# EasyEDA Pro project ProPrj_42StepMotor_2025-09-30.epro, board motor
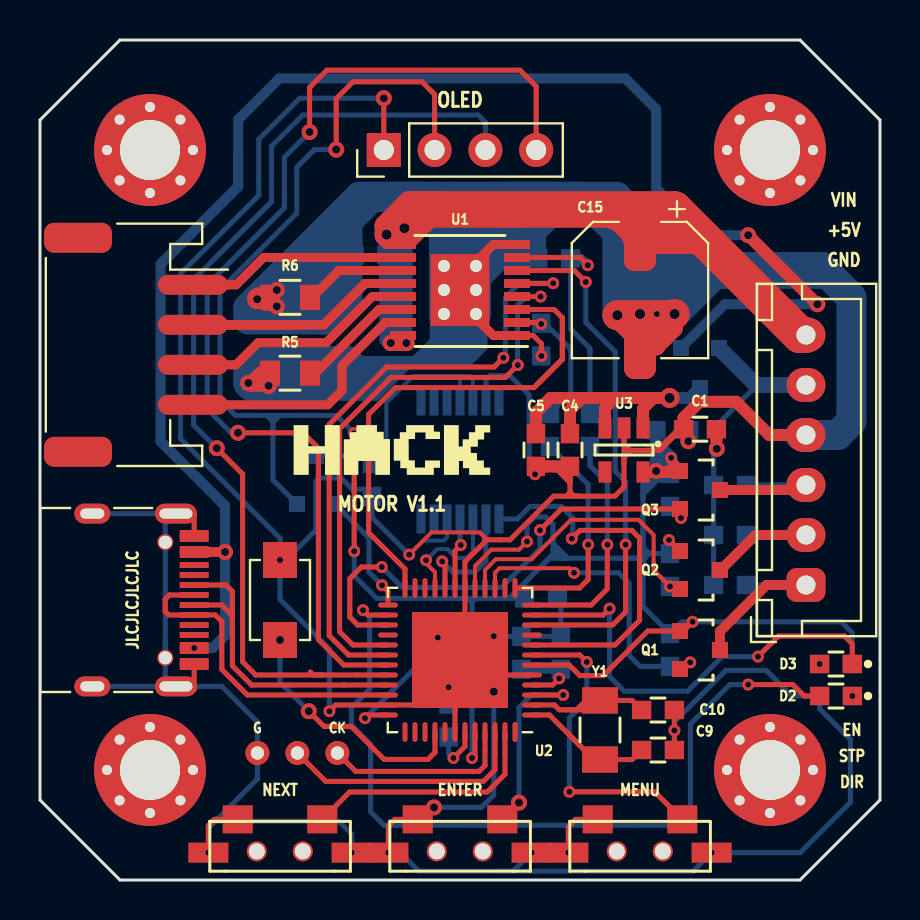
[diagram p2: board, top side]
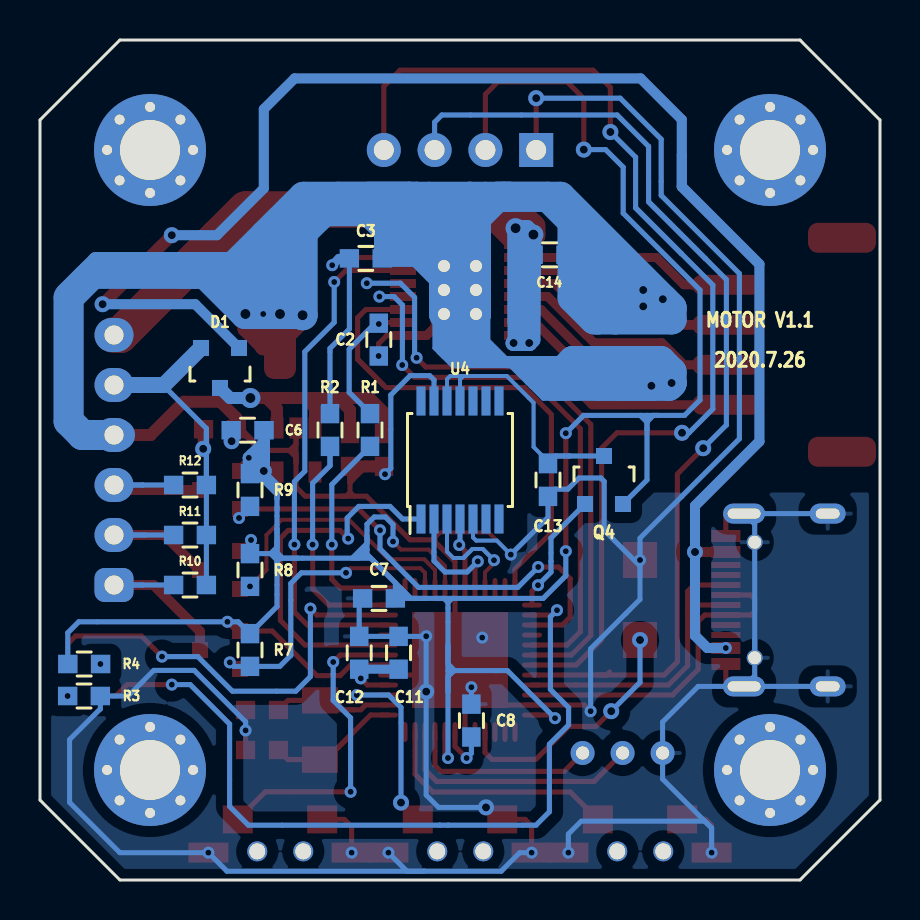
[diagram p3: board, bottom side, seen from below]

Outline 42 x 42 mm; copper layers: Top Layer, Bottom Layer. Coordinates in mm from the lower left corner of the outline.
Outline path: 0,38 4,42 38,42 42,38 42,4 38,0 4,0 0,4 0,38
Stack: Top Layer 0.035mm / Dielectric1 1.51mm FR4 er 4.5 / Bottom Layer 0.035mm

## Design rules (mm)
spacing safeClearance (default): track to track 0.152, other pairs 0.152 to 0.3
track width trackWidth (default): min 0.127, default 0.254, max 2.54
differential pair differentialPair (default): width min 0.127, default 0.254, max 2.54; gap min 0.152, default 0.152
via viaSize (default): diameter min 0.5, default 0.61, max 10; hole min 0.3, default 0.305, max 6
pour ie1768 uses CopperRegion

## Placement (name value [footprint] x y rotation side)
C1  0.1uF  [NewLibCool:0603_C]  33 22.54 0 top
C2  0.1uF  [NewLibCool:0603_C]  25.06 27.02 90 bottom
C3  0.1uF  [NewLibCool:0603_C]  25.71 31.08 0 bottom
C4  0.1uF  [NewLibCool:0603_C]  26.5 21.5 90 top
C5  0.1uF  [NewLibCool:0603_C]  24.8 21.5 90 top
C6  0.1uF  [NewLibCool:0603_C]  31.62 22.49 180 bottom
C7  0.1uF  [NewLibCool:0603_C]  25.05 14.08 180 bottom
C8  1uF  [NewLibCool:0603_C]  20.43 7.97 90 bottom
C9  10pF  [NewLibCool:0603_C]  30.9 8.5 180 top
C10  10pF  [NewLibCool:0603_C]  30.9 6.5 180 top
C11  0.1uF  [NewLibCool:0603_C]  24.07 11.36 270 bottom
C12  4.7uF  [NewLibCool:0603_C]  26.04 11.36 270 bottom
C13  0.1uF  [NewLibCool:0603_C]  16.6 20 90 bottom
C14  0.1uF  [NewLibCool:0603_C]  16.52 31.26 0 bottom
C15  100uF  [Capacitor_SMD:CP_Elec_6.3x5.4_Nichicon]  30 29.5 270 top
D1  BAT54C  [NewLibCool:SOT-23]  33 25.6 0 bottom
D2  LED  [NewLibCool:0603_LED]  39.8 9.2 180 top
D3  LED  [NewLibCool:0603_LED]  39.8 10.8 180 top
G***  LOGO  [NewLibCool:LOGO_HACK_10MM]  17.6 21.5 0 top
J1  CONN_01X04  [Connector_JST:JST_PH_S4B-PH-SM4-TB_1x04-1MP_P2.00mm_Horizontal]  4.8 26.76 270 top
J2  Conn_01x06_Male  [Connector_JST:JST_XH_B6B-XH-A_1x06_P2.50mm_Vertical]  38.3 14.75 90 top
J3  CONN_01X04  [Connector_PinHeader_2.54mm:PinHeader_1x04_P2.54mm_Vertical]  17.19 36.5 90 top
P1  -  [NewLibCool:USB-Type-C-NEW]  7.71 14 270 top
P1#2  -  [NewLibCool:O_5.6_3mm]  5.5 36.5 0 top
P1#3  -  [NewLibCool:O_5.6_3mm]  36.5 5.5 0 top
P1#4  -  [NewLibCool:O_5.6_3mm]  5.5 5.5 0 top
P1#5  -  [NewLibCool:O_5.6_3mm]  36.5 36.5 0 top
P2  CONN_01X03  [NewLibCool:JLINK3]  11.87 6.35 270 top
Q1  BSS138  [NewLibCool:SOT-23]  33 11.5 270 top
Q2  BSS138  [NewLibCool:SOT-23]  33 15.5 270 top
Q3  BSS138  [NewLibCool:SOT-23]  33 19.5 270 top
Q4  AO3401A  [NewLibCool:SOT-23-L]  13.8 20 180 bottom
R1  3.3K  [NewLibCool:0603_R]  25.5 22.5 270 bottom
R2  3.3K  [NewLibCool:0603_R]  27.5 22.5 270 bottom
R3  3.3K  [NewLibCool:0603_R]  39.8 9.2 180 bottom
R4  3.3K  [NewLibCool:0603_R]  39.79 10.8 0 bottom
R5  0.1R  [NewLibCool:0805_R]  12.5 25.34 0 top
R6  0.1R  [NewLibCool:0805_R]  12.5 29.13 0 top
R7  10K  [NewLibCool:0603_R]  31.5 11.5 90 bottom
R8  10K  [NewLibCool:0603_R]  31.5 15.5 90 bottom
R9  10K  [NewLibCool:0603_R]  31.5 19.5 90 bottom
R10  10K  [NewLibCool:0603_R]  34.5 14.75 180 bottom
R11  10K  [NewLibCool:0603_R]  34.5 17.25 180 bottom
R12  10K  [NewLibCool:0603_R]  34.5 19.75 180 bottom
SW1  ENTER  [NewLibCool:SWITCH_PUSH]  21 2.2 0 top
SW2  MENU  [NewLibCool:SWITCH_PUSH]  30 2.2 0 top
SW3  NEXT  [NewLibCool:SWITCH_PUSH]  12 2.2 0 top
SW4  RESET  [NewLibCool:switchx3x4]  12 14 90 top
U1  A4954  [Package_SO:TSSOP-16-1EP_4.4x5mm_P0.65mm]  21 29.5 180 top
U2  ATSAMD21G18A-MF  [NewLibCool:QFN-48-1EP_7x7mm_P0.5mm_ATSAMD21G18]  21 11 180 top
U3  SPX3819  [NewLibCool:SOT23-5]  29.2 21.5 270 top
U4  AS5047D  [Package_SO:TSSOP-14_4.4x5mm_P0.65mm]  21 21 90 bottom
Y1  32.768KHz  [NewLibCool:OSC_32.768_Mini]  28 7.5 270 top

## Footprints (pads in the part's own frame, mm; a bottom-side part is the same pattern mirrored in y, then rotated)
Capacitor_SMD:CP_Elec_6.3x5.4_Nichicon
  rrect 3.5x1.6 smd: 1(-2.7,0) 2(2.7,0)
Connector_JST:JST_PH_S4B-PH-SM4-TB_1x04-1MP_P2.00mm_Horizontal
  rrect 1x3.5 smd: 1(-3,2.85) 2(-1,2.85) 3(1,2.85) 4(3,2.85)
  rrect 1.5x3.4 smd: MP(-5.35,-2.9) MP(5.35,-2.9)
Connector_JST:JST_XH_B6B-XH-A_1x06_P2.50mm_Vertical
  rrect 1.7x1.95 hole 0.95: 1(0,0)
  oval 1.7x1.95 hole 0.95: 2(2.5,0) 3(5,0) 4(7.5,0) 5(10,0) 6(12.5,0)
Connector_PinHeader_2.54mm:PinHeader_1x04_P2.54mm_Vertical
  rect 1.7x1.7 hole 1: 1(0,0)
  round 1.7 hole 1: 2(0,-2.54) 3(0,-5.08) 4(0,-7.62)
NewLibCool:0603_C
  rect 0.965x0.92 smd: 1(-0.82,0) 2(0.82,0)
NewLibCool:0603_LED
  rect 0.965x0.92 smd: 1(-0.82,0) 2(0.82,0)
NewLibCool:0603_R
  rect 0.965x0.92 smd: 1(-0.82,0) 2(0.82,0)
NewLibCool:0805_R
  rect 1x1.25 smd: 1(-1,0) 2(1,0)
NewLibCool:JLINK3
  round 1.2 hole 0.66: 1(0,3) 2(0,1) 3(0,-1)
NewLibCool:O_5.6_3mm
  round 0.6 hole 0.5: 1(-2.15,0) 1(-1.52,1.52) 1(-1.52,-1.52) 1(0,-2.15) 1(1.52,1.52) 1(1.52,-1.52) 1(2.15,0)
  round 1 hole 0.5: 1(0,2.15)
  round 5.6 hole 3: 1(0,0)
NewLibCool:OSC_32.768_Mini
  rect 1.32x1.8 smd: 1(-1.48,0) 2(1.48,0)
NewLibCool:QFN-48-1EP_7x7mm_P0.5mm_ATSAMD21G18
  rrect 1x0.25 smd: 1(-3.6,2.75) 2(-3.6,2.25) 3(-3.6,1.75) 4(-3.6,1.25) 5(-3.6,0.75) 6(-3.6,0.25) 7(-3.6,-0.25) 8(-3.6,-0.75) 9(-3.6,-1.25) 10(-3.6,-1.75) 11(-3.6,-2.25) 12(-3.6,-2.75) 25(3.6,-2.75) 26(3.6,-2.25) 27(3.6,-1.75) 28(3.6,-1.25) 29(3.6,-0.75) 30(3.6,-0.25) 31(3.6,0.25) 32(3.6,0.75) 33(3.6,1.25) 34(3.6,1.75) 35(3.6,2.25) 36(3.6,2.75)
  rrect 0.25x1 smd: 13(-2.75,-3.6) 14(-2.25,-3.6) 15(-1.75,-3.6) 16(-1.25,-3.6) 17(-0.75,-3.6) 18(-0.25,-3.6) 19(0.25,-3.6) 20(0.75,-3.6) 21(1.25,-3.6) 22(1.75,-3.6) 23(2.25,-3.6) 24(2.75,-3.6) 37(2.75,3.6) 38(2.25,3.6) 39(1.75,3.6) 40(1.25,3.6) 41(0.75,3.6) 42(0.25,3.6) 43(-0.25,3.6) 44(-0.75,3.6) 45(-1.25,3.6) 46(-1.75,3.6) 47(-2.25,3.6) 48(-2.75,3.6)
  rect 4.8x4.8 smd: 35(0,0)
NewLibCool:SOT23-5
  rect 1.06x0.65 smd: 1(-1.1,0.95) 2(-1.1,0) 3(-1.1,-0.95) 4(1.1,-0.95) 5(1.1,0.95)
NewLibCool:SOT-23
  rect 0.8x0.8 smd: 1(-0.95,-1.001) 2(0.95,-1.001) 3(0,0.998)
NewLibCool:SOT-23-L
  rect 0.8x0.8 smd: 1(-0.95,-1.2) 2(0.95,-1.2) 3(0,1.2)
NewLibCool:SWITCH_PUSH
  round 1 hole 0.8: 0(-1.163,-0.768) 0(1.137,-0.768)
  rect 2x1 smd: 1(-3.582,-0.832) 1(3.582,-0.832)
  rect 1.5x1.4 smd: 1(-2.112,0.832) 2(2.112,0.832)
NewLibCool:switchx3x4
  rect 1.8x1.7 smd: 1(-2,0) 2(2,0)
NewLibCool:USB-Type-C-NEW
  rect 0.6x1.45 smd: A1(-3.2,0) A4(-2.4,0) A4(2.4,0) S1(3.2,0)
  rect 0.3x1.45 smd: A5(-1.75,0) A5(-1.25,0) A6(-0.25,0) A6(0.75,0) A7(-0.75,0) A7(0.25,0) B5(1.25,0) B5(1.75,0)
  rrect 1x2.1 hole 0.5x1.65: S1(-4.32,-0.915) S1(4.32,-0.915)
  rrect 1x1.8 hole 0.5x1.2: S1(-4.32,-5.095) S1(4.32,-5.095)
  round 0.8 hole 0.65: S1(-2.89,-1.445) S1(2.89,-1.445)
Package_SO:TSSOP-14_4.4x5mm_P0.65mm
  rect 1.45x0.45 smd: 1(-2.95,1.95) 2(-2.95,1.3) 3(-2.95,0.65) 4(-2.95,0) 5(-2.95,-0.65) 6(-2.95,-1.3) 7(-2.95,-1.95) 8(2.95,-1.95) 9(2.95,-1.3) 10(2.95,-0.65) 11(2.95,0) 12(2.95,0.65) 13(2.95,1.3) 14(2.95,1.95)
Package_SO:TSSOP-16-1EP_4.4x5mm_P0.65mm
  rect 1.3x0.45 smd: 1(-2.85,2.275) 2(-2.85,1.625) 3(-2.85,0.975) 4(-2.85,0.325) 5(-2.85,-0.325) 6(-2.85,-0.975) 7(-2.85,-1.625) 8(-2.85,-2.275) 9(2.85,-2.275) 10(2.85,-1.625) 11(2.85,-0.975) 12(2.85,-0.325) 13(2.85,0.325) 14(2.85,0.975) 15(2.85,1.625) 16(2.85,2.275)
  round 1.2 hole 0.6: 8(-0.8,1.2) 8(-0.8,0) 8(-0.8,-1.2) 8(0.8,1.2) 8(0.8,0) 8(0.8,-1.2)
  rect 1.47x0.895 smd: 8(-0.735,1.343) 8(-0.735,0.448) 8(-0.735,-0.448) 8(-0.735,-1.343) 8(0.735,1.343) 8(0.735,0.448) 8(0.735,-0.448) 8(0.735,-1.343)

## Nets
+3V3: C6.2 C7.2 J3.2 Q1.1 Q2.1 Q3.1 Q4.2 R4.2 R7.2 R8.2 R9.2 U2.6 U2.17 U2.36 U2.44 U3.5
/5V: C1.2 D1.2 J2.5 R10.2 R11.2 R12.2
/VBUS: D1.1 P1.A4
/VIN: C14.2 C15.1 J2.6 U1.9 U1.16
GND: C1.1 C2.1 C3.1 C4.1 C5.1 C6.1 C7.1 C8.2 C9.1 C10.1 C11.1 C12.1 C13.1 C14.1 C15.2 J2.4 J3.1 P1.A1 P1.S1 P2.3 R3.2 R5.1 R6.1 SW1.1 SW2.1 SW3.1 SW4.2 U1.1 U1.8 U2.5 U2.18 U2.35 U2.42 U3.2 U4.5 U4.13
/A0: SW1.2 U2.3
/A1: SW2.2 U2.7
/A2: U2.8 U4.1
/A3: U2.9
/A4: U1.6 U2.10
/A5: SW3.2 U2.47
/AREF: C11.2 C12.2 U2.4
/D0: Q2.2 R8.1 U2.16
/D1: Q1.2 R7.1 U2.15
/D2: U2.23
/D3: U2.14
/D4: R1.2 U2.13
/D5: U1.3 U2.24
/D6: U1.4 U2.29
/D7: U1.5 U2.30
/D8: D3.1 U2.11
/D9: R2.2 U2.12
/D10: Q3.2 R9.1 U2.27
/D11: Q4.1 U2.25
/D12: U2.28
/D13: D2.2 U2.26
/DIR: J2.1 Q1.3 R10.1
/EN: J2.3 Q3.3 R12.1
/MISO: U2.21 U4.3
/MOSI: U2.19 U4.4
/RESET: SW4.1 U2.40
/RXD: U2.38
/SCK: U2.20 U4.2
/SCL: J3.3 U2.32
/SDA: J3.4 U2.31
/STP: J2.2 Q2.3 R11.1
/SWCLK: P2.1 U2.45
/SWDIO: P2.2 U2.46
/TXD: U2.37
NET-(C2-PAD2): C2.2 R1.1 U1.2
NET-(C3-PAD2): C3.2 R2.1 U1.7
NET-(C4-PAD2): C4.2 C5.2 D1.3 U3.1 U3.3
NET-(C8-PAD1): C8.1 U2.43
NET-(C9-PAD2): C9.2 U2.2 Y1.1
NET-(C10-PAD2): C10.2 U2.1 Y1.2
NET-(C13-PAD2): C13.2 Q4.3 U4.11 U4.12
NET-(D2-PAD1): D2.1 R3.1
NET-(D3-PAD2): D3.2 R4.1
NET-(J1-PAD1): J1.1 U1.10
NET-(J1-PAD2): J1.2 U1.12
NET-(J1-PAD3): J1.3 U1.13
NET-(J1-PAD4): J1.4 U1.15
NET-(P1-PADA5): P1.A5
NET-(P1-PADA6): P1.A6 U2.34
NET-(P1-PADA7): P1.A7 U2.33
NET-(P1-PADB5): P1.B5
NET-(R5-PAD2): R5.2 U1.14
NET-(R6-PAD2): R6.2 U1.11
NET-(U2-PAD22): U2.22
NET-(U2-PAD39): U2.39
NET-(U2-PAD41): U2.41
NET-(U2-PAD48): U2.48
NET-(U3-PAD4): U3.4
NET-(U4-PAD6): U4.6
NET-(U4-PAD7): U4.7
NET-(U4-PAD8): U4.8
NET-(U4-PAD9): U4.9
NET-(U4-PAD10): U4.10
NET-(U4-PAD14): U4.14

Pads without a net: J1 MP; P1#2 1; P1#3 1; P1#4 1; P1#5 1; SW1 0; SW2 0; SW3 0

## Via types
v1: diameter 0.6, hole 0.3, Top Layer to Bottom Layer, 57 vias
v2: diameter 0.8, hole 0.4, Top Layer to Bottom Layer, 23 vias
v3: diameter 1, hole 0.5, Top Layer to Bottom Layer, 6 vias

## Routing (per net, layer and track width the routed paths; a pad name or vN(x,y) marks a point on that pad's centre or on a via; arc(x,y) is an arc through that point)
+3V3: length 154.4
  Top Layer w0.2: v1(24.35,16.92) 23.95,16.52 22.57,16.52 21.75,15.7 U2.17
  Top Layer w0.254: v2(14.81,36.52) 14.81,39.07 15.65,39.91 19.1,39.91 19.73,39.28 J3.2 ; v1(21.6,6.1) 21.75,6.25 U2.44 ; v1(31.56,21.11) 32,20.67 Q3.1 ; U2.36 16.41,8.25 v1(16.25,8.09) ; 32,16.45 v1(31.45,17) ; v1(15.71,16.44) v1(15.71,22.34) ; v1(32.63,12.91) 32.17,12.45 Q1.1 30.39,12.45 28.16,10.22 26.99,10.22 26.46,10.75 U2.6
  Top Layer w0.3: 30.73,20.45 v2(30.81,20.45) 30.47,20.45 ; 30.73,20.45 31.28,20.45 31.56,20.73 v1(31.56,21.11) ; 30.73,20.45 31.51,20.45 31.73,20.23 31.78,20.23 Q3.1
  Top Layer w0.6: Q3.1 31.95,20.4 U3.5
  Bottom Layer w0.254: 21.28,14.08 21.4,14.08 21.6,13.88 ; 21.28,14.08 16.84,14.08 15.71,15.21 v1(15.71,16.44) ; 21.28,14.08 22.21,14.08 ; 21.6,13.88 21.8,14.08 22.21,14.08 ; 21.6,13.88 21.6,11.75 ; 30.15,15.38 30.15,15.93 29.99,16.09 ; 30.15,15.38 30.15,15.71 ; 30.15,15.38 30.15,13.67 R7.2 32.09,12.91 v1(32.63,12.91) 40.06,12.91 40.61,12.36 R4.2 ; 21.27,10.47 21.6,10.8 21.6,11.75 ; 21.27,10.47 21.6,10.47 ; 21.27,10.47 21.3,10.47 ; v1(21.6,6.1) 21.6,9.41 ; 21.6,9.41 21.6,10.17 21.3,10.47 ; 21.6,9.41 21.6,10.47 ; 30.15,19.64 30.15,19.79 v2(30.81,20.45) ; 30.15,19.64 30.15,19.21 ; 30.15,19.64 30.5,19.99 31.17,19.99 R9.2 ; 25.65,16.51 25.65,17.19 ; 25.65,16.51 25.65,16.28 ; 25.65,16.51 26.07,16.09 26.31,16.09 ; v1(31.45,17) 31.45,16.37 R8.2 30.47,16.32 ; 11.65,22.53 11.65,20 Q4.2 ; 11.65,22.53 11.65,22.89 11.99,23.23 ; 11.65,22.53 11.65,22.91 ; 30.15,15.71 30.15,16 30.47,16.32 ; 30.15,15.71 30.15,16.25 ; 26.39,16.09 25.65,16.83 25.65,17.19 ; 26.39,16.09 29.11,16.09 ; 26.39,16.09 26.31,16.09 ; v2(14.81,36.52) 13.72,36.52 12.84,35.64 12.84,33.34 9,29.5 9,24 9.77,23.23 11.14,23.23 ; 26.31,16.09 25.46,16.09 25.17,15.8 ; 25.65,16.28 25.17,15.8 ; 25.65,16.28 24.23,14.86 C7.2 22.66,14.08 ; 29.99,16.09 30.15,16.25 ; 29.99,16.09 29.11,16.09 ; 29.99,16.09 30.22,16.32 30.47,16.32 ; 30.15,16.25 30.15,17.55 ; 29.11,16.09 29.87,16.09 30.15,16.37 30.15,16.94 ; 22.21,14.08 22.66,14.08 ; 30.15,17.55 30.15,16.94 ; 30.15,17.55 30.15,19.07 ; 30.15,16.94 30.15,16.64 30.47,16.32 ; 22.66,14.08 23.45,14.08 25.17,15.8 ; 25.65,17.19 25.65,17.79 25.29,18.15 24.73,18.15 24.35,17.77 v1(24.35,16.92) ; 21.6,11.75 21.6,10.47 ; 30.15,19.21 30.15,19.07 ; 30.15,19.21 30.15,19.58 30.89,20.32 R9.2 ; 30.15,19.07 30.15,19.28 31.19,20.32 R9.2 ; 11.65,22.91 11.33,23.23 11.14,23.23 ; 11.65,22.91 11.65,23.23 ; v1(15.71,22.34) 14.82,23.23 11.99,23.23 ; 11.65,23.23 11.14,23.23 ; 11.65,23.23 11.99,23.23 ; 21.3,10.47 18.63,10.47 v1(16.25,8.09)
  Bottom Layer w0.6: v1(31.56,21.11) 31.56,20.38 R9.2 30.94,20.32 v2(30.81,20.45) ; v1(31.56,21.11) 30.8,21.87 C6.2 30.8,20.46 v2(30.81,20.45) ; v1(31.56,21.11) 31.4,21.28 30.81,20.69 v2(30.81,20.45)
/5V: length 26.1
  Top Layer w0.6: v2(33.84,21.56) 33.82,21.58 C1.2
  Bottom Layer w0.254: R10.2 R11.2 R12.2 ; R12.2 33.68,22.39 ; R12.2 33.68,21.4 v2(33.84,21.56) 33.68,21.72 33.68,22.39 ; 33.68,22.39 33.68,22.58 35.85,24.75
  Bottom Layer w0.6: 38,24.75 36.72,24.75 ; 36.72,24.75 35.84,24.75 33.99,26.6 ; 36.72,24.75 J2.5
  Bottom Layer w0.8: D1.2 35.8,24.75 J2.5
/VBUS: length 97.8
  Top Layer w0.5: P1.A4 v2(9.25,16.4)
  Top Layer w0.6: v2(38.87,28.79) 38.86,28.79 v2(35.41,32.24)
  Bottom Layer w0.5: 9.91,34.67 6.03,30.79 ; 9.91,34.67 9.91,36.25 ; 9.91,34.67 6.03,30.79 ; 9.91,34.67 9.91,36.25 ; 8.63,11.6 9.25,12.22 ; 8.63,11.6 9.25,12.22 ; 8.63,11.6 v1(7.71,11.6) ; 9.25,12.22 v2(9.25,16.4) ; 9.25,12.22 9.25,14.19 ; 6.03,30.79 6.03,21.93 ; 6.03,21.93 9.25,18.71 ; 6.03,21.93 9.25,18.71 ; v2(35.41,32.24) 33.15,32.24 30.81,34.58 30.81,38.54 29.27,40.08 11.97,40.08 9.91,38.02 9.91,36.25 ; 9.25,18.71 9.25,14.19 ; 9.25,18.71 v2(9.25,16.4) ; v2(9.25,16.4) 9.25,14.19 ; v2(38.87,28.79) 34.24,28.79 D1.1
/VIN: length 143.5
  Top Layer w0.254: U1.16 18,27.22
  Top Layer w0.45: v3(18.22,32.59) 18.22,31.78 18.22,31.78 ; 18.22,31.78 19.04,32.59 19.34,32.59 ; 18.22,31.78 17.73,32.27 v3(17.33,32.27) 17.15,32.09 16.99,32.09 17.31,31.78 18.22,31.78 ; 18.22,31.78 18.53,31.78 19.34,32.59 ; U1.16 18,27.22 v2(17.54,26.85) ; U1.16 17.69,26.85 v2(17.54,26.85) ; U1.16 18.32,27.19 v2(18.32,26.85) 18.32,27.13 18.22,27.22 v2(17.54,26.85) ; 19.34,32.59 20.13,33.38 21.34,33.38
  Top Layer w0.5: v3(17.33,32.27) 17.33,32.76 18.45,33.88 21.04,33.88 21.54,33.38
  Top Layer w0.6: 37.16,28.09 38,27.25
  Top Layer w0.8: v2(18.32,26.85) v2(17.54,26.85)
  Top Layer w1.2: 19.95,33.38 21.54,33.38 21.34,33.38 22.82,33.38 ; 19.95,33.38 19.95,33.84 18.48,33.84 17.33,32.69 v3(17.33,32.27) 18.44,33.38 19.95,33.38 ; 38,27.25 33.05,32.2 C15.1
  Top Layer w1.5: 25.66,33.38 24.34,33.38 ; 25.66,33.38 31.92,33.38 33.59,31.71 33.59,31.66 ; 25.66,33.38 28.82,33.38 C15.1 ; 24.34,33.38 19.01,33.38 v3(18.22,32.59) ; 24.34,33.38 22.82,33.38
  Top Layer w1.8: 28.82,33.38 31.87,33.38 38,27.25 ; 38,27.25 37.16,28.09 ; 38,27.25 J2.6 ; 38,27.25 33.05,32.2 C15.1 ; 33.47,31.78 31.71,33.54 18.6,33.54 18.44,33.38
  Bottom Layer w0.45: v3(18.22,32.59) 18.22,26.95 v2(18.32,26.85) ; v3(17.33,32.27) 17.38,27.01 v2(17.54,26.85) 17.49,27.15
  Bottom Layer w0.6: v3(17.33,32.27) 17.65,32.59 ; v3(17.33,32.27) 17.65,32.59 ; v3(17.33,32.27) 17.65,32.59
  Bottom Layer w0.8: 17.77,27.43 17.77,27.76 17.77,27.43 ; 17.77,27.43 17.49,27.15 ; 17.77,27.43 17.49,27.15 ; 17.77,27.43 17.9,27.56 ; 17.65,32.59 v3(17.33,32.27) ; 17.65,32.59 v3(18.22,32.59) ; 17.65,32.59 v3(17.33,32.27) ; 17.65,32.59 v3(18.22,32.59) ; v3(17.33,32.27) 17.9,32.27 v3(18.22,32.59) ; v3(17.33,32.27) 17.49,32.11 v2(17.54,26.85) ; v3(17.33,32.27) 17.38,27.01 v2(17.54,26.85) ; v2(17.54,26.85) 17.49,27.15 ; v2(17.54,26.85) 18.26,26.85 17.9,26.85 17.9,27.56 ; 17.9,27.56 18.22,27.88 v3(18.22,32.59) ; v3(18.22,32.59) 18.22,26.95 v2(18.32,26.85)
GND: length 621.4
  Top Layer w0.2: 22.21,17.15 21.98,17.38 19.57,17.38 v1(18.46,16.27) ; 22.21,17.15 22.35,17.01 ; 22.21,17.15 22.21,16.89 21.98,16.66 21.98,16.64
  Top Layer w0.254: v1(24.58,1.37) v1(26.42,1.37) 26.42,2.67 26.78,3.03 SW2.1 ; 30.32,21.48 30.86,21.48 31.92,22.54 C1.1 ; 30.32,21.48 29.54,21.48 ; 30.32,21.48 30.99,21.48 32.05,22.54 C1.1 ; 29.2,20.89 29.2,21.31 29.37,21.48 29.51,21.48 ; 29.2,20.89 U3.2 29.2,21.79 29.51,21.48 ; 29.2,20.89 29.2,20.82 ; U2.35 21.25,11.25 U2.18 21.25,15.91 22.35,17.01 23.5,17.01 25.68,19.19 26.3,19.19 ; U2.35 20.75,10.75 U2.42 ; U2.35 21.11,11 v2(22.69,9.42) ; U2.35 21.75,10.25 U2.5 ; U2.35 21,10.21 v1(20.43,9.64) ; U2.35 18.75,8.75 U2.35 14.78,8.75 v1(14.47,8.44) ; U2.35 21.5,11 v1(22.69,12.19) ; 23.78,27.22 24.66,27.22 25.07,26.82 v1(25.07,26.2) ; P1.S1 7.67,18.32 7.71,18.28 P1.A1 ; v2(19.7,3.63) 19.1,3.03 SW1.1 17.74,3.03 17.42,2.71 v1(17.42,1.37) v1(15.58,1.37) ; 25.69,20.68 26.5,19.87 26.5,19.85 ; 26.92,19.19 28.74,19.19 29.2,19.65 29.2,20.82 ; 26.92,19.19 26.3,19.19 ; 26.92,19.19 26.7,19.19 26.5,19.39 ; J3.1 v2(17.19,39.09) ; 26.5,19.85 C4.1 ; 26.5,19.85 26.5,20.14 26.01,20.63 25.36,20.63 25.36,20.68 ; 26.5,19.85 26.5,19.39 ; C1.1 32.18,22.18 v2(32.42,21.94) ; 26.3,19.19 26.5,19.39 ; C10.1 v1(31.72,7.48) C9.1 ; 29.54,21.48 29.2,21.14 29.2,20.82 ; 29.54,21.48 29.51,21.48 ; C5.1 24.8,20.34 v1(24.75,20.29) ; SW3.1 8.72,3.03 8.42,2.73 v1(8.42,1.37) ; P1.S1 7.71,9.54 7.57,9.68 P1.S1 ; 22.67,31.78 U1.8
  Top Layer w0.45: 23.78,27.22 22.67,27.22 U1.8 U1.8 ; U1.8 22.67,31.78 23.78,31.78 ; 20.26,29.66 21.66,29.66 21.8,29.8 21.74,29.86 ; 11.29,24.85 v2(11.43,24.71) ; 11.26,28.68 v2(11.84,28.68) ; 11.28,29.46 v2(10.86,29.04) ; 11.28,29.5 v2(11.84,29.5)
  Top Layer w0.6: 29.65,25.78 29.65,27.95 v3(30,28.3) ; J2.4 36.47,22.25 ; 36.47,22.25 38,22.25 ; 36.47,22.25 34.81,23.91 32.98,23.91 32.18,23.11 C1.1 ; v2(10.42,24.85) 10.56,24.71 v2(11.43,24.71) ; C4.1 C5.1 ; 30,26.14 30,26.13
  Top Layer w0.8: v2(10.42,24.85) 10.64,24.85 11.13,25.34 ; v3(30,28.3) 30,26.14 ; v3(30,28.3) v1(30.84,28.3) v3(31.73,28.3) ; v3(30,28.3) 30,27.48 30.84,26.64 30.84,26.67 31.73,27.56 v3(31.73,28.3) ; v3(31.73,28.3) 30,26.57 30,26.13 ; 11.29,24.85 v2(11.43,24.71)
  Top Layer w1: 10.96,29.14 v2(10.86,29.04) ; 10.86,29.08 11.42,29.08
  Top Layer w1.2: 31.67,28.24 v3(31.73,28.3) ; v3(28.87,28.24) 30,27.11 C15.2
  Top Layer w1.5: v3(31.73,28.3) 31.67,28.24 v3(28.87,28.24)
  Bottom Layer w0.2: v1(18.46,16.27) 19.16,16.97 20.19,16.97 20.35,17.13 U4.5
  Bottom Layer w0.254: 21.8,27.17 21.8,27.37 ; 21.8,27.17 21.8,26.32 21.65,26.17 ; 21.8,27.17 20.3,27.17 20.2,27.27 ; 21.8,27.37 21.8,27.54 ; 21.8,27.37 20.25,27.37 20.2,27.32 ; v1(18.46,16.27) 16.6,18.13 C13.1 16.24,19.54 15.61,19.54 15.05,20.1 13.96,20.1 13.79,19.93 13.79,17.49 12,15.7 ; 18.97,26.16 19.03,26.1 21.19,26.1 ; 12,15.7 12,15.98 ; 12,15.7 12,14.03 14.47,11.56 v1(14.47,8.44) ; 19.26,26.45 19.38,26.33 21.61,26.33 ; 8.42,2.6 v1(8.42,1.37) 8.42,1.37 8.41,1.37 ; 8.42,2.6 10.87,5.05 P2.3 10.87,7.9 9.09,9.68 P1.S1 ; 8.42,2.6 8.76,2.94 14.94,2.94 15.58,2.3 v1(15.58,1.37) ; C6.1 32.44,21.96 v2(32.42,21.94) ; 12,15.98 v1(12,16) ; 12,15.98 v1(12,16) ; v1(12,16) 12,17.09 7.03,22.06 7.03,30.32 10.94,34.23 10.94,37.04 12.99,39.09 v2(17.19,39.09) ; P1.S1 6.26,10.21 6.26,12.02 ; P1.S1 P1.S1 ; 17.62,24.88 17.97,25.23 ; 17.62,24.88 17.44,24.7 ; 17.62,24.88 16.52,24.88 16.5,24.86 ; 17.97,25.23 16.87,25.23 16.55,24.91 ; 17.97,25.23 18.46,25.72 20.92,25.72 ; v1(24.75,20.29) 24.46,20.58 24.46,24.25 23.49,25.22 22.52,25.22 22.3,25 U4.13 ; 17.44,24.7 16.83,24.09 15.73,24.09 15.11,24.71 13.07,24.71 ; 17.44,24.7 16.45,24.7 16.4,24.75 ; 20.92,25.72 21.36,25.72 22.03,26.39 22.03,28.08 U1.8 21.8,27.54 ; 20.92,25.72 21.2,25.72 21.65,26.17 ; C8.2 v1(20.43,9.64) ; C7.1 26.04,13.91 C12.1 22.7,12.18 v1(22.69,12.19) v2(22.69,9.42) 22.69,4.25 22.07,3.63 v2(19.7,3.63) ; 21.8,27.54 20.21,27.54 20.2,27.53 ; 22.79,0.44 32.65,0.44 v1(33.58,1.37) 38.01,1.37 40.52,3.88 40.52,7.02 38.98,8.56 R3.2 37.59,9.2 36.31,10.48 34.29,10.48 31.72,7.91 v1(31.72,7.48) ; 22.79,0.44 23.65,0.44 v1(24.58,1.37) ; 22.79,0.44 18.94,0.44 18.01,1.37 v1(17.42,1.37) ; 6.26,12.02 6.26,11.11 ; 6.26,12.02 6.26,17.79 P1.S1 P1.S1 ; 21.66,27 20.01,27 19.91,27.1 ; U1.8 22.25,29.05 22.25,26.61 21.81,26.17 21.65,26.17 ; 16.55,24.91 17.05,25.41 17.97,25.41 ; 16.55,24.91 16.72,25.08 17.62,25.08 ; 16.55,24.91 16.55,25.19 16.93,25.57 18.13,25.57 ; 21.32,26.25 19.23,26.25 19.15,26.33 19.61,26.8 19.61,28.91 U1.8 ; 21.67,26.66 19.66,26.66 19.56,26.75 ; 19.31,26.5 19.32,26.51 21.63,26.51 ; 21.65,26.84 19.74,26.84 19.69,26.89 ; 21.61,26.33 21.64,26.36 ; 21.61,26.33 21.22,25.94 15.35,25.94 15.34,25.95 ; v1(25.07,26.2) C2.1
  Bottom Layer w0.45: v2(10.86,29.04) 10.85,29.03 10.82,29.03 ; v2(10.86,29.04) 11.48,29.04 v2(11.84,28.68) v2(11.84,29.5) ; v2(10.86,29.04) 11.06,29.24 11.58,29.24 v2(11.84,29.5) ; 20.2,27.39 19.88,27.39 19.77,27.5 ; 20.2,27.39 18.63,25.82 15.47,25.82 15.34,25.95 ; 20.2,27.39 20.2,27.27 U1.8 ; 10.42,28.6 10.42,27.9 10.42,29.1 10.82,29.5 v2(11.84,29.5) ; 10.56,24.71 v2(10.42,24.85) ; 22.18,31.08 U1.8
  Bottom Layer w0.5: 19.69,26.89 18.76,25.95 13.68,25.95
  Bottom Layer w0.6: 37.31,30.31 37.31,30.54 ; 37.31,30.31 37.31,30.54 ; 37.31,30.31 37.31,30.54 ; 39.88,22.25 40.79,23.16 40.79,29.41
  Bottom Layer w0.8: 30,31.48 30,29.91 30,31.68 ; 30,31.48 30,30.03 v3(31.73,28.3) ; 30,31.48 30,29.84 ; 30,31.48 30,31.68 ; 30,29.14 30,29.22 v3(30,28.3) v3(31.73,28.3) ; 30,29.14 v1(30.84,28.3) v3(31.73,28.3) ; 30,29.14 30,29.84 ; v3(31.73,28.3) 31.54,28.3 30,29.84 ; v3(31.73,28.3) 31.73,28.96 ; 23.22,31.08 22.18,31.08 U1.8 ; 23.22,31.08 21.8,29.66 U1.8 ; 23.22,31.08 C3.1 ; 31.73,28.96 31.73,28.98 32.01,29.27 ; 31.73,28.96 30,30.69 30,31.87 ; 32.01,29.27 33.06,30.31 ; 32.01,29.27 30,31.28 30,32.6 30,31.87 ; 22.89,32.62 23.88,31.62 24.89,31.62 ; 40.79,29.41 39.2,31 37.3,31 ; 40.79,29.41 39.89,30.31 34.94,30.31 ; 40.79,29.41 40.79,23.16 39.88,22.25 38,22.25 ; 21.8,32.79 23.51,31.08 C3.1 ; 34.94,30.31 36.09,30.31 36.78,31 37.3,31 ; 34.94,30.31 33.06,30.31 ; 33.06,30.31 32.67,30.31 ; 23.58,34.16 24.89,32.85 C3.1 ; 23.55,33.34 24.89,32 C3.1 ; 30,31.87 30,31.68 ; 37.3,31 31.6,31 30.75,31.85 30.75,32.23 ; 25.29,33.37 24.89,32.97 C3.1 ; 22.19,30.29 22.98,31.08 C3.1 ; 21.8,31.83 22.55,31.08 C3.1 ; 24.89,31.62 24.89,32.3 25.68,33.09 28.17,33.09 ; 24.89,31.62 C3.1 ; C3.1 24.89,31.23 22.56,33.56 22.56,34.16
  Bottom Layer w1.2: 31.67,28.24 v3(31.73,28.3)
  Bottom Layer w1.5: 13.24,28.03 14.09,28.03 ; 13.24,28.03 10.42,28.03 10.42,28.6 ; 13.24,28.03 13.24,29.25 12.99,29.5 ; 14.09,28.03 14.28,28.03 15.37,29.12 15.37,31.88 ; 14.09,28.03 14.09,30.6 14.13,30.56 14.13,29.85 14.13,30.64 ; 18.82,34.16 18.52,34.16 19.15,34.16 ; 18.82,34.16 20.52,34.16 ; 18.82,34.16 16.6,34.16 15.37,32.93 15.37,31.88 ; 19.15,34.16 20.2,33.11 U1.8 U1.8 ; 19.15,34.16 15.98,34.16 10.42,28.6 ; 12.97,24.71 v2(11.43,24.71) ; 12.97,24.71 10.56,24.71 ; 12.97,24.71 14.1,24.71 15.34,25.95 ; v2(11.43,24.71) 11.29,24.85 v2(10.42,24.85) ; v2(11.43,24.71) 16.35,24.71 16.55,24.91 16.38,24.91 15.34,25.95 ; 37.31,30.54 33.97,30.54 v3(31.73,28.3) 28.93,28.3 v3(28.87,28.24) 28.87,32.39 ; 20.52,34.16 23.51,34.16 ; 20.52,34.16 21.8,32.88 21.8,32.4 ; 20.52,34.16 21.38,33.3 21.38,29.48 U1.8 ; 10.56,24.71 v2(10.42,24.85) ; 10.56,24.71 v2(10.42,24.85) ; 28.87,32.39 27.1,34.16 25.56,34.16 ; 28.87,32.39 29.96,32.39 32.04,30.31 ; v2(11.84,29.5) 12.99,29.5 ; 12.99,29.5 14.13,30.64 ; 21.8,32.4 21.8,32.79 ; 21.8,32.4 20.2,30.8 U1.8 ; 14.13,30.64 15.37,31.88 ; 23.51,34.16 28.82,34.16 32.67,30.31 39.38,30.31 40.57,29.12 40.57,22.94 39.88,22.25 ; 23.51,34.16 25.56,34.16 ; 32.04,30.31 31.5,29.78 ; 32.04,30.31 34.94,30.31 ; 25.56,34.16 23.17,34.16 21.8,32.79 ; 15.34,25.95 10.97,25.95 10.42,25.4 v2(10.42,24.85) ; 10.42,28.6 v2(10.86,29.04) ; 21.8,32.79 U1.8 U1.8 ; U1.8 U1.8 ; 39.88,22.25 38,22.25 ; 39.88,22.25 J2.4
  vias: v1(19.89,12.12)
/A0: length 10
  Top Layer w0.254: SW1.2 v2(23.95,3.87) ; U2.3 v1(26.16,9.25)
  Bottom Layer w0.254: v1(26.16,9.25) 24.57,9.25 23.95,8.63 v2(23.95,3.87)
/A1: length 15.9
  Top Layer w0.254: U2.7 26.99,11.25 v1(27.34,10.9) ; v1(26.47,4.41) 30.73,4.41 SW2.2
  Bottom Layer w0.254: v1(27.34,10.9) 27.34,8.98 26.47,8.11 v1(26.47,4.41)
/A2: length 19
  Top Layer w0.254: v1(26.59,17.07) 27,17.48 29.59,17.48 29.98,17.09 29.98,12.98 28.75,11.75 U2.8
  Bottom Layer w0.254: U4.1 23.87,18.05 24.5,18.68 26.06,18.68 26.64,18.1 26.64,17.12 v1(26.59,17.07)
/A4: length 26
  Top Layer w0.254: 23.78,30.47 26.72,30.47 v1(27.29,29.9) ; U2.10 28.63,12.75 29.28,13.4 v1(29.28,16.77)
  Bottom Layer w0.254: v1(29.28,16.77) 29.28,19.92 28.76,20.44 28.76,26.41 27.29,27.88 v1(27.29,29.9)
/A5: length 12.2
  Top Layer w0.254: SW3.2 15.48,4.4 22.36,4.4 23.25,5.29 U2.47
/AREF: length 4
  Top Layer w0.254: v1(25.96,10.08) 25.63,9.75 U2.4
  Bottom Layer w0.254: C12.2 26.04,10.16 v1(25.96,10.08)
  Bottom Layer w0.45: C11.2 C12.2
/D0: length 15.3
  Top Layer w0.2: 30.68,15.5 30.68,17.25 29.92,18.01 26.55,18.01 24.58,16.04 22.79,16.04 22.25,15.5 U2.16 ; 30.68,15.5 v1(31.5,14.68) 30.68,15.5
  Top Layer w0.254: Q2.2 31.63,14.55 v1(31.5,14.68)
/D1: length 15.5
  Top Layer w0.2: U2.15 22.75,15.36 22.98,15.59 26.47,15.59 v1(26.7,15.36)
  Top Layer w0.254: Q1.2 32.33,10.88 v1(32.51,10.88)
  Bottom Layer w0.254: v1(26.7,15.36) 28.93,15.36 29.46,14.83 29.46,11.23 30.01,10.68 R7.1 32.31,10.68 v1(32.51,10.88)
/D4: length 11.3
  Top Layer w0.254: v1(27.41,16.77) 27.41,15.03 26.98,14.6 U2.13
  Bottom Layer w0.254: v1(27.41,16.77) 27.41,19.77 R1.2
/D5: length 30.6
  Top Layer w0.254: 23.78,28.53 25.71,28.53 26.12,28.11 ; 26.12,26.04 24.83,24.75 26.12,26.04 ; 26.12,26.04 24.7,24.62 17.77,24.62 16.43,23.28 16.43,17.37 18.25,15.55 U2.24 ; 26.12,26.04 26.12,28.11 ; 26.12,26.04 26.12,28.11
/D6: length 28.7
  Top Layer w0.254: U2.29 15.65,11.75 14.98,12.42 14.98,22.56 17.55,25.13 23.27,25.13 v1(23.89,25.75) ; 23.78,29.17 25.03,29.17 v1(25.03,29.17)
  Bottom Layer w0.254: v1(25.03,29.17) 24.3,29.17 23.88,28.75 23.88,25.75 v1(23.89,25.75)
/D7: length 31.6
  Top Layer w0.254: v1(25.66,29.84) 25.65,29.83 23.78,29.83 ; U2.30 15.43,11.25 14.46,12.22 14.46,22.78 17.33,25.65 22.71,25.65 v1(23.17,26.11)
  Bottom Layer w0.254: v1(25.66,29.84) 23.98,29.84 23.27,29.13 23.27,26.21 v1(23.17,26.11)
/D8: length 22.2
  Top Layer w0.254: D3.1 40.62,11.8 40.22,12.2 36.93,12.2 v1(35.9,11.17) ; v1(28.48,13.57) 28.16,13.25 U2.11
  Bottom Layer w0.254: v1(35.9,11.17) 34.11,11.17 32.38,9.44 29.21,9.44 28.48,10.17 v1(28.48,13.57)
/D9: length 12.6
  Top Layer w0.254: v1(28.37,16.77) 28.36,14.55 27.56,13.75 U2.12
  Bottom Layer w0.254: 27.5,20.71 28.37,19.84 v1(28.37,16.77) ; 27.5,20.71 R2.2 27.5,20.71
/D10: length 25.1
  Top Layer w0.254: v1(32.05,18.1) 32,18.15 Q3.2 ; Q3.2 31.97,18.55 ; Q3.2 31.88,18.55 ; Q3.2 26.06,18.55 v1(25,17.49) ; Q3.2 31.73,18.82 ; U2.27 15.88,12.75 15.49,13.14 15.49,15.07 16.07,15.65 v1(17.09,15.65)
  Bottom Layer w0.254: v1(32.05,18.1) 31.5,18.65 R9.1 ; v1(25,17.49) 25,16.56 23.07,14.63 18.11,14.63 v1(17.09,15.65)
/D11: length 6.1
  Top Layer w0.254: U2.25 17.4,14.44 v1(17.1,14.74)
  Bottom Layer w0.254: v1(17.1,14.74) 16.45,15.39 16.45,17.1 Q4.1
/D13: length 40.6
  Top Layer w0.254: v1(35.41,9.77) 37.64,9.77 38.21,9.2 D2.2 ; U2.26 16.39,13.25 v1(16.15,13.49)
  Bottom Layer w0.254: v1(35.41,9.77) 34.49,9.77 32.52,7.8 32.52,3.68 31.58,2.74 17.2,2.74 16.53,3.41 16.53,6.79 15.57,7.75 15.57,8.62 16.48,9.53 16.48,13.16 v1(16.15,13.49)
/DIR: length 11.5
  Top Layer w0.5: 36.86,14.75 J2.1 ; 36.86,14.75 36.32,14.75 34,12.43 Q1.3 ; 36.86,14.75 38,14.75
  Bottom Layer w0.254: 36.85,14.75 38,14.75 ; 36.85,14.75 R10.1 ; 36.85,14.75 J2.1
/EN: length 10.1
  Top Layer w0.5: 36.53,19.5 37.75,19.5 38,19.75 ; 36.53,19.5 38.05,19.5 J2.3 ; 36.53,19.5 Q3.3
  Bottom Layer w0.254: 36.87,19.75 J2.3 ; 36.87,19.75 R12.1 ; 36.87,19.75 38,19.75
/MISO: length 8.2
  Top Layer w0.2: U2.21 19.75,15.39 19.3,15.84 v1(19.3,15.99)
  Bottom Layer w0.2: 20.38,16.55 20.83,16.1 ; 20.38,16.55 20.83,16.1 ; 20.38,16.55 20.83,16.1 ; 20.38,16.55 19.86,16.55 ; 20.83,16.1 21.33,16.1 21.65,16.42 U4.3 ; 19.86,16.55 v1(19.3,15.99) 19.86,16.55
/MOSI: length 3.6
  Top Layer w0.254: v1(21.04,16.75) 20.75,16.46 U2.19
  Bottom Layer w0.254: U4.4 21,16.79 v1(21.04,16.75)
/RESET: length 12.6
  Top Layer w0.254: U2.40 19.75,6.38 19.4,6.03 17.21,6.03 15.56,7.68 14.2,7.68 v2(13.44,8.44)
  Bottom Layer w0.254: v2(13.44,8.44) 12,9.88 v2(12,12)
/SCK: length 6.3
  Top Layer w0.254: 20.25,15.79 v1(20.11,15.93) 20.25,15.79 ; 20.25,15.79 U2.20
  Bottom Layer w0.254: v1(20.11,15.93) 20.64,15.4 21.75,15.4 22.3,15.95 U4.2 ; v1(20.11,15.93) 20.1,15.92 v1(20.11,15.93)
/SCL: length 53.5
  Top Layer w0.254: 14.14,10.25 13.67,10.25 13.52,10.4 ; 14.14,10.25 U2.32 ; 14.14,10.25 10.79,10.25 10.13,10.91 10.13,20.3 v2(8.84,21.59)
  Bottom Layer w0.254: 8.72,31.06 11.57,33.91 ; 8.72,31.06 7.68,30.02 7.68,22.75 v2(8.84,21.59) ; 8.72,31.06 11.57,33.91 ; 11.57,33.91 11.57,36.68 13.14,38.25 21.91,38.25 22.27,37.89 J3.3
/SDA: length 56.9
  Top Layer w0.254: v2(9.9,22.36) 13.15,22.36 13.92,21.59 13.92,12.02 15.19,10.75 U2.31 ; J3.4 24.81,39.68 24,40.49 14.34,40.49 13.48,39.63 v2(13.48,37.4)
  Bottom Layer w0.254: 9.93,31.31 8.36,29.75 8.36,23.55 9.55,22.36 ; 9.93,31.31 12.22,33.61 ; 9.93,31.31 12.22,33.61 ; 9.55,22.36 v2(9.9,22.36) 9.55,22.36 ; 12.22,33.61 12.22,36.14 v2(13.48,37.4)
/STP: length 10.2
  Top Layer w0.5: Q2.3 34.03,15.5 35.78,17.25 37.02,17.25 ; 37.02,17.25 J2.2 ; 37.02,17.25 38,17.25
  Bottom Layer w0.254: 36.75,17.25 38,17.25 ; 36.75,17.25 J2.2 ; 36.75,17.25 R11.1
/SWCLK: length 9.6
  Top Layer w0.254: U2.45 22.25,5.72 21.96,5.43 15.79,5.43 P2.1
/SWDIO: length 12.6
  Top Layer w0.254: P2.2 14.29,4.93 22.17,4.93 22.75,5.51 U2.46
NET-(C2-PAD2): length 7.1
  Top Layer w0.254: 24.99,27.88 v1(25.06,27.8) 24.99,27.88 ; 24.99,27.88 23.78,27.88
  Bottom Layer w0.254: v1(25.06,27.8) C2.2 25.24,27.84 26.54,26.54 26.54,24.38 25.5,23.34 R1.1
NET-(C3-PAD2): length 14.4
  Top Layer w0.254: 23.78,31.12 27,31.12 v1(27.39,30.74)
  Bottom Layer w0.254: C3.2 26.53,27.55 27.5,26.58 R2.1 ; C3.2 26.35,30.9 C3.2 ; C3.2 27.05,31.08 v1(27.39,30.74)
  Bottom Layer w0.45: C3.2 27.05,31.08 v1(27.39,30.74)
NET-(C4-PAD2): length 20.5
  Top Layer w0.6: C4.2 26.5,23.5 27.1,24.1 ; C5.2 24.8,23.38 25.52,24.1 27.1,24.1 ; 27.1,24.1 v3(31.48,24.1) ; v3(31.48,24.1) 28.74,24.1 28.25,23.61 U3.3 ; v3(31.48,24.1) 30.68,24.1 30.15,23.57 U3.1
  Bottom Layer w0.6: 32.5,24.1 v3(31.48,24.1) 32.5,24.1 ; 32.5,24.1 D1.3 32.5,24.1
NET-(C8-PAD1): length 2.7
  Top Layer w0.254: U2.43 21.25,6.68 v1(20.67,6.1)
  Bottom Layer w0.254: C8.1 20.43,6.34 v1(20.67,6.1)
NET-(C9-PAD2): length 7.8
  Top Layer w0.254: C9.2 29.6,8.98 Y1.1 27.53,8.51 26.29,8.51 ; 26.29,8.51 26.83,8.51 27.5,9.18 27.89,9.18 ; 26.29,8.51 25.96,8.51 25.72,8.75 U2.2
NET-(C10-PAD2): length 8.5
  Top Layer w0.254: U2.1 25.47,8.25 26.45,7.27 ; 26.45,7.27 27.7,6.02 Y1.2 29.6,6.02 C10.2 ; 26.45,7.27 27.5,6.22 27.89,6.22
NET-(C13-PAD2): length 17.7
  Bottom Layer w0.2: U4.11 21,25.03 20.83,25.2 18.66,25.2 ; 18.66,25.2 21.49,25.2 21.65,25.04 U4.12 ; 18.66,25.2 17.32,23.86 17.32,21.65 16.87,21.2 16.45,21.2
  Bottom Layer w0.254: Q4.3 15.51,21.2 ; 15.51,21.2 16.93,21.2 16.6,20.87 C13.2 16.22,21.2 15.51,21.2
NET-(D2-PAD1):
  vias: v1(40.62,9.2)
NET-(D3-PAD2): length 0
  Bottom Layer w0.254: v1(38.98,10.8) R4.1
NET-(J1-PAD1): length 14.5
  Top Layer w0.45: 7.85,29.76 9.41,29.76 J1.1 9.81,29.76 11.18,31.12 18.22,31.12
NET-(J1-PAD2): length 31.5
  Top Layer w0.45: J1.2 14.19,27.76 ; J1.2 14.19,27.76 ; J1.2 13.11,27.76 7.85,27.76 ; 14.19,27.76 16.25,29.83 ; 14.19,27.76 16.25,29.83 ; 16.25,29.83 U1.12
NET-(J1-PAD3): length 11.9
  Top Layer w0.45: U1.13 16.62,29.17 14.31,26.87 10.91,26.87 9.8,25.76 J1.3
NET-(J1-PAD4): length 13.7
  Top Layer w0.45: 18.22,27.88 17.49,27.88 ; J1.4 14.39,23.76 15.1,24.47 15.1,25.72 17.25,27.88 U1.15
NET-(P1-PADA6): length 16.4
  Top Layer w0.254: P1.A6 6.47,14.25 6.26,14.04 6.26,13.43 6.44,13.25 P1.A6 8.76,13.25 9.09,12.92 9.09,10.53 10.37,9.25 U2.34
NET-(P1-PADA7): length 16.1
  Top Layer w0.254: 9.62,13.21 9.62,10.71 10.58,9.75 U2.33 ; 9.62,13.21 9.08,13.75 P1.A7 ; 9.62,13.21 9.62,14.43 9.3,14.75 P1.A7
NET-(R5-PAD2): length 6
  Top Layer w0.45: U1.14 16.94,28.53 13.76,25.34 R5.2
NET-(R6-PAD2): length 5.2
  Top Layer w0.45: 18.22,30.47 14.94,30.47 13.6,29.13

## Copper pours and planes (outline as drawn; the poured copper is in the pictures)
GND on Bottom Layer: 42,4 38,0 4,0 0,4 0,19.67 42,19.67

## Text on the board
Bottom Silkscreen Layer: MOTOR V1.1 | 2020.7.26
Top Silkscreen Layer: G | CK | NEXT | ENTER | MENU | EN | STP | DIR | JLCJLCJLCJLC | VIN | +5V | GND | OLED | MOTOR V1.1
